# Altium schematic sheet LedControl.SchDoc
size A3
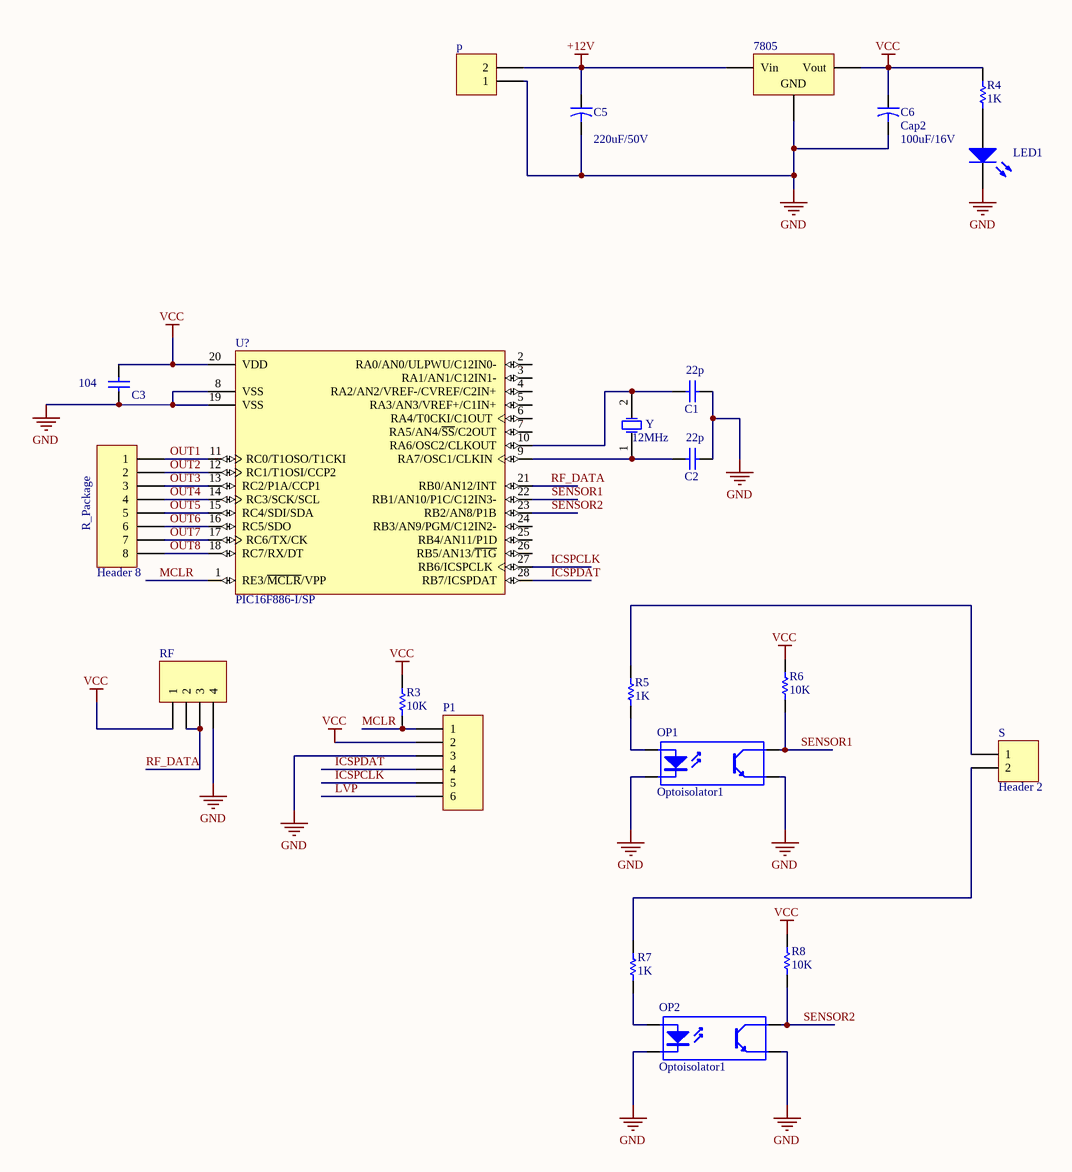
[diagram p0: LedControl.SchDoc]

## Parts
7805  Volt Reg  [78xx_NO]  (value not drawn)
C1  C: 22p  [C104_PINK]  (hidden comment: Ceramic)
C2  C: 22p  [C104_PINK]  (hidden comment: Ceramic)
C3  C: 104  [C104_YELLOW]  (hidden comment: Ceramic)
C5  value 220uF/50V  [TU 220uF/50V]  (hidden comment: Cap2)
C6  Cap2  value 100uF/16V  [tu 100uF/50v]
LED1  LED1  [LED_3]  (value not drawn)
OP1  Optoisolator1  [DIP-4]
OP2  Optoisolator1  [DIP-4]
p  Header 2  [Header2 - duplicate]  (value not drawn)
P1  Header 6  [HDR1X6]  (value not drawn)
R3  10K  [R_Nor]
R4  value 1K  [R_Nor]  (hidden comment: 10K)
R5  value 1K  [R_Nor]  (hidden comment: 10K)
R6  10K  [R_Nor]
R7  value 1K  [R_Nor]  (hidden comment: 10K)
R8  10K  [R_Nor]
R_Package  Header 8  [HDR1X8]
RF  Header 4  [RF_Receive]  (value not drawn)
S  Header 2  [HDR1X2]
U?  PIC16F886-I/SP  [SPDIP300-SP28]
Y  value 12MHz  [Xtal12M]  (hidden comment: XTAL)

## Nets
+12V: 7805.1(Vin) C5.1 p.2
GND: 7805.2(GND) C1.2 C2.2 C3.1 C5.2 C6.2 LED1.2(K) OP1.2(K) OP1.3(E) OP2.2(K) OP2.3(E) p.1 P1.3 RF.4 U?.8(VSS) U?.19(VSS)
VCC: 7805.3(Vout) C3.2 C6.1 P1.2 R3.2 R4.1 R6.2 R8.2 RF.1 U?.20(VDD)
ICSPCLK: P1.5 U?.27(RB6/ICSPCLK)
ICSPDAT: P1.4 U?.28(RB7/ICSPDAT)
LVP: P1.6
MCLR: P1.1 R3.1 U?.1(RE3/~{MCLR}/VPP)
OUT1: R_Package.1 U?.11(RC0/T1OSO/T1CKI)
OUT2: R_Package.2 U?.12(RC1/T1OSI/CCP2)
OUT3: R_Package.3 U?.13(RC2/P1A/CCP1)
OUT4: R_Package.4 U?.14(RC3/SCK/SCL)
OUT5: R_Package.5 U?.15(RC4/SDI/SDA)
OUT6: R_Package.6 U?.16(RC5/SDO)
OUT7: R_Package.7 U?.17(RC6/TX/CK)
OUT8: R_Package.8 U?.18(RC7/RX/DT)
RF_DATA: RF.2 RF.3 U?.21(RB0/AN12/INT)
SENSOR1: OP1.4(C) R6.1 U?.22(RB1/AN10/P1C/C12IN3-)
SENSOR2: OP2.4(C) R8.1 U?.23(RB2/AN8/P1B)
NetC1_1: C1.1 U?.10(RA6/OSC2/CLKOUT) Y.2(OSC2)
NetC2_1: C2.1 U?.9(RA7/OSC1/CLKIN) Y.1(OSC1)
NetLED1_1: LED1.1(A) R4.2
NetOP1_1: OP1.1(A) R5.1
NetOP2_1: OP2.1(A) R7.1
NetR5_2: R5.2 S.1
NetR7_2: R7.2 S.2

Not connected (* = marked no-connect by the designer): U? 2(RA0/AN0/ULPWU/C12IN0-) 3(RA1/AN1/C12IN1-) 4(RA2/AN2/VREF-/CVREF/C2IN+) 5(RA3/AN3/VREF+/C1IN+) 6(RA4/T0CKI/C1OUT) 7(RA5/AN4/~{SS}/C2OUT) 24(RB3/AN9/PGM/C12IN2-) 25(RB4/AN11/P1D) 26(RB5/AN13/~{T1G})

## Library data of the parts
7805 = Volt Reg: Voltage Regulator; Published: 24-Mar-1999; LatestRevisionDate: 29-May-2009; LatestRevisionNote: IPC-7351 Footprint Added.; PackageReference: D2PAK; Publisher: Altium Limited; PackageDescription: 3-Pin Transistor Outline Package 2.54 mm Pitch, 15.1 mm Lead Span
C1-C3 = Ceramic: Capacitor
C5 C6 = Cap2: Capacitor; Published: 23-Sep-2002; PackageReference: CAPR5-4X5; Publisher: Altium Limited
LED1 = LED1: Typical RED GaAs LED; Published: 8-Jun-2000; LatestRevisionDate: 08-Jul-2005; LatestRevisionNote: Mech Layer 1 removed.; PackageReference: LED-1; Publisher: Altium Limited
OP1 OP2 = Optoisolator1: 4-Pin Phototransistor Optocoupler; Published: 24-Mar-1999; LatestRevisionDate: 04-Mar-2005; LatestRevisionNote: Sch pins 3 & 4 Swapped.; DatasheetVersion: Nov-2003; PackageReference: DIP-4; Publisher: Altium Limited
p S = Header 2: Header, 2-Pin; LatestRevisionDate: 17-Jul-2002; LatestRevisionNote: Re-released for DXP Platform.; Publisher: Altium Limited
P1 = Header 6: Header, 6-Pin; LatestRevisionDate: 17-Jul-2002; LatestRevisionNote: Re-released for DXP Platform.; Publisher: Altium Limited
R3-R8 = Res1: Resistor; Published: 8-Jun-2000; LatestRevisionDate: 17-Jul-2002; LatestRevisionNote: Re-released for DXP Platform.; PackageReference: AXIAL-0.3; Publisher: Altium Limited
  R3 R6 R8: Value: 10K
R_Package = Header 8: Header, 8-Pin; LatestRevisionDate: 17-Jul-2002; LatestRevisionNote: Re-released for DXP Platform.; Publisher: Altium Limited
RF = Header 4: Header, 4-Pin; LatestRevisionDate: 17-Jul-2002; LatestRevisionNote: Re-released for DXP Platform.; Publisher: Altium Limited
U? = PIC16F886-I/SP: Flash-Based, 8-Bit CMOS Microcontroller with nanoWatt Technology, 8K (x14-Bit words) Program Memory, 624 Bytes Data Memory, 24 I/O pins, 28-Pin SPDIP, Standard VDD Range, Industrial Temperature; FirstPublished: 29-Jan-2009; LatestRevisionDate: 02-Dec-2009; LatestRevisionNote: Updated datasheet to version revF, Apr-2009.; DatasheetVersion: revF, Apr-2009; PackageVersion: revBB, Aug-2009; PackageReference: SPDIP300-SP28; Publisher: Altium Limited; PackageDescription: 28-Lead Skinny Plastic Dual In-Line (SP) - 300 mil Body [SPDIP]; Supplier 1: Digi-Key; Supplier Part Number 1: PIC16F886-I/SP-ND; Supplier 2: Farnell; Supplier Part Number 2: 1439539; Supplier 3: Newark; Supplier Part Number 3: 74K8577; ComponentLink1Description: Datasheet; ComponentLink1URL: http://ww1.microchip.com/downloads/en/DeviceDoc/41291F.pdf; ComponentLink2Description: Packaging Specification; ComponentLink2URL: http://www.microchip.com/stellent/groups/techpub_sg/documents/packagingspec/en012702.pdf; ComponentLink3Description: Microchip.com Home; ComponentLink3URL: http://www.microchip.com/
Y = XTAL: Crystal Oscillator; Published: 8-Jun-2000; LatestRevisionDate: 17-Jul-2002; LatestRevisionNote: Re-released for DXP Platform.; PackageReference: R38; Publisher: Altium Limited